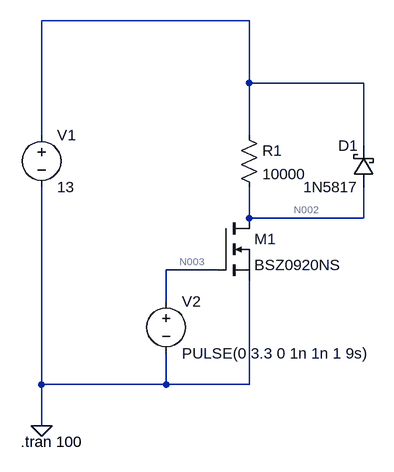
[diagram p0: schematic Draft3.asc]
Draft3.asc, the LTspice schematic file:
Version 4.1
SHEET 1 880 680
WIRE 240 -144 -80 -144
WIRE 240 -48 240 -144
WIRE 416 -48 240 -48
WIRE -80 32 -80 -144
WIRE 240 32 240 -48
WIRE 416 48 416 -48
WIRE 240 160 240 112
WIRE 416 160 416 112
WIRE 416 160 240 160
WIRE 192 240 112 240
WIRE 112 288 112 240
WIRE -80 416 -80 112
WIRE 112 416 112 368
WIRE 112 416 -80 416
WIRE 240 416 240 256
WIRE 240 416 112 416
WIRE -80 480 -80 416
FLAG -80 480 0
SYMBOL nmos 192 160 R0
SYMATTR InstName M1
SYMATTR Value BSZ0920NS
SYMBOL res 224 16 R0
SYMATTR InstName R1
SYMATTR Value 10000
SYMBOL schottky 432 112 R180
WINDOW 0 24 64 Left 2
WINDOW 3 24 0 Left 2
SYMATTR InstName D1
SYMATTR Value 1N5817
SYMATTR Description Diode
SYMATTR Type diode
SYMBOL voltage -80 16 R0
WINDOW 123 0 0 Left 0
WINDOW 39 0 0 Left 0
SYMATTR InstName V1
SYMATTR Value 13
SYMBOL voltage 112 272 R0
WINDOW 123 0 0 Left 0
WINDOW 39 0 0 Left 0
SYMATTR InstName V2
SYMATTR Value PULSE(0 3.3 0 1n 1n 1 9s)
TEXT -112 504 Left 2 !.tran 100

The netlist it stands for:
* Draft3.asc
M1 N002 N003 0 0 BSZ0920NS
R1 N001 N002 10000
D1 N002 N001 1N5817
V1 N001 0 13
V2 N003 0 PULSE(0 3.3 0 1n 1n 1 9s)
.model D D
.lib standard.dio
.model NMOS NMOS
.model PMOS PMOS
.lib standard.mos
.tran 100
.backanno
.end

* Results of the author's LTspice run, read from the files saved beside the schematic
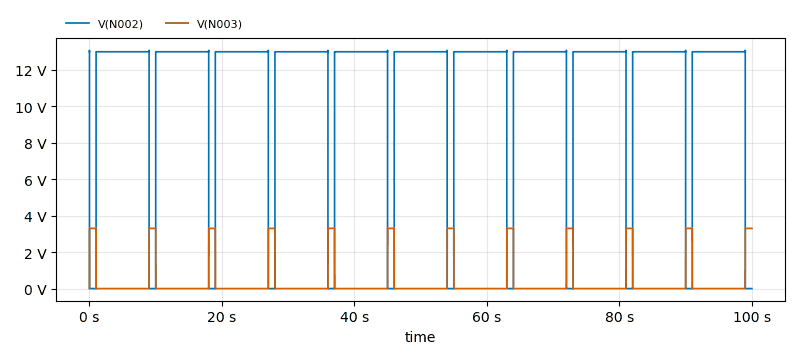
[diagram p1: Transient Analysis of Draft3.asc, plotted from the saved traces]
* Transient Analysis, 1 run:
*   V(N002): min -12.79 mV, max 13.08 V, average 11.44 V, rms 12.2 V, last 42.89 µV
*   V(N003): min 0 V, max 3.3 V, average 396 mV, rms 1.143 V, last 3.3 V